# EAGLE schematic ATCUxxxl3U_Synth (EAGLE 5.11)
OC_NEWARK: unknown

## Sheet 1 of 7
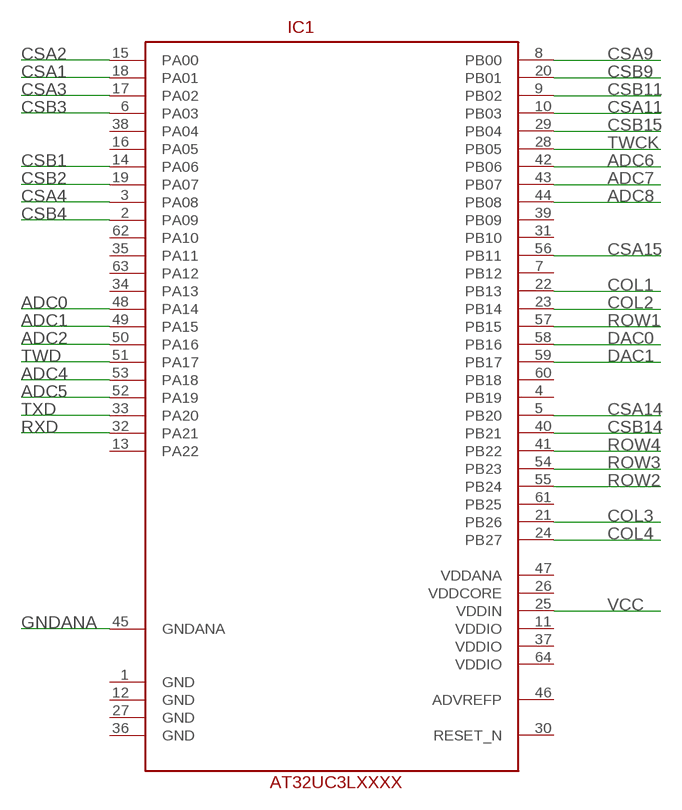
[diagram p0: schematic, sheet 1]

### Parts
IC1  ATCXXXL3U  [TQFP64]

### Nets
ADC0: IC1.48(PA14) ; also sheet 4
ADC1: IC1.49(PA15) ; also sheet 4
ADC2: IC1.50(PA16) ; also sheet 4
ADC4: IC1.53(PA18) ; also sheet 4
ADC5: IC1.52(PA19) ; also sheet 4
ADC6: IC1.42(PB06) ; also sheet 4
ADC7: IC1.43(PB07) ; also sheet 4
ADC8: IC1.44(PB08) ; also sheet 4
COL1: IC1.22(PB13) ; also sheet 7
COL2: IC1.23(PB14) ; also sheet 7
COL3: IC1.21(PB26) ; also sheet 7
COL4: IC1.24(PB27) ; also sheet 7
CSA1: IC1.18(PA01) ; also sheet 2
CSA2: IC1.15(PA00) ; also sheet 2
CSA3: IC1.17(PA02) ; also sheet 2
CSA4: IC1.3(PA08) ; also sheet 2
CSA9: IC1.8(PB00) ; also sheet 2
CSA11: IC1.10(PB03) ; also sheet 2
CSA14: IC1.5(PB20) ; also sheet 2
CSA15: IC1.56(PB11) ; also sheet 2
CSB1: IC1.14(PA06) ; also sheet 2
CSB2: IC1.19(PA07) ; also sheet 2
CSB3: IC1.6(PA03) ; also sheet 2
CSB4: IC1.2(PA09) ; also sheet 2
CSB9: IC1.20(PB01) ; also sheet 2
CSB11: IC1.9(PB02) ; also sheet 2
CSB14: IC1.40(PB21) ; also sheet 2
CSB15: IC1.29(PB04) ; also sheet 2
DAC0: IC1.58(PB16) ; also sheet 3
DAC1: IC1.59(PB17) ; also sheet 3
GNDANA: IC1.45(GNDANA) ; also sheet 4
ROW1: IC1.57(PB15) ; also sheet 7
ROW2: IC1.55(PB24) ; also sheet 7
ROW3: IC1.54(PB23) ; also sheet 7
ROW4: IC1.41(PB22) ; also sheet 7
RXD: IC1.32(PA21) ; also sheet 5
TWCK: IC1.28(PB05) ; also sheet 6
TWD: IC1.51(PA17) ; also sheet 6
TXD: IC1.33(PA20) ; also sheet 5
VCC: IC1.25(VDDIN) ; also sheet 3,4,6
Unconnected: IC1.1(GND) IC1.4(PB19) IC1.7(PB12) IC1.11(VDDIO) IC1.12(GND) IC1.13(PA22) IC1.16(PA05) IC1.26(VDDCORE) IC1.27(GND) IC1.30(RESET_N) IC1.31(PB10) IC1.34(PA13) IC1.35(PA11) IC1.36(GND) IC1.37(VDDIO) IC1.38(PA04) IC1.39(PB09) IC1.46(ADVREFP) IC1.47(VDDANA) IC1.60(PB18) IC1.61(PB25) IC1.62(PA10) IC1.63(PA12) IC1.64(VDDIO)

## Sheet 2 of 7
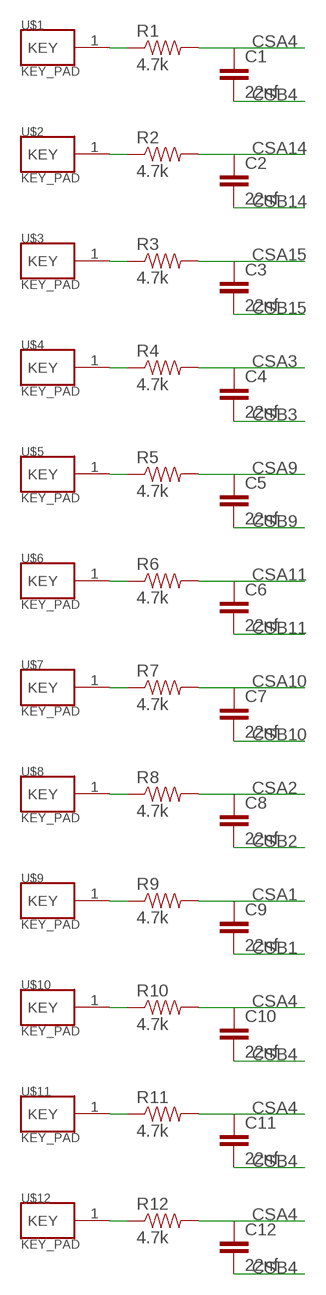
[diagram p1: schematic, sheet 2]

### Parts
C1  22nf  CAP0805  [0805]
C2  22nf  CAP0805  [0805]
C3  22nf  CAP0805  [0805]
C4  22nf  CAP0805  [0805]
C5  22nf  CAP0805  [0805]
C6  22nf  CAP0805  [0805]
C7  22nf  CAP0805  [0805]
C8  22nf  CAP0805  [0805]
C9  22nf  CAP0805  [0805]
C10  22nf  CAP0805  [0805]
C11  22nf  CAP0805  [0805]
C12  22nf  CAP0805  [0805]
R1  4.7k  RESISTOR0805-RES  [0805]
R2  4.7k  RESISTOR0805-RES  [0805]
R3  4.7k  RESISTOR0805-RES  [0805]
R4  4.7k  RESISTOR0805-RES  [0805]
R5  4.7k  RESISTOR0805-RES  [0805]
R6  4.7k  RESISTOR0805-RES  [0805]
R7  4.7k  RESISTOR0805-RES  [0805]
R8  4.7k  RESISTOR0805-RES  [0805]
R9  4.7k  RESISTOR0805-RES  [0805]
R10  4.7k  RESISTOR0805-RES  [0805]
R11  4.7k  RESISTOR0805-RES  [0805]
R12  4.7k  RESISTOR0805-RES  [0805]
U$1  KEY_PAD  [KEY_PAD]
U$2  KEY_PAD  [KEY_PAD]
U$3  KEY_PAD  [KEY_PAD]
U$4  KEY_PAD  [KEY_PAD]
U$5  KEY_PAD  [KEY_PAD]
U$6  KEY_PAD  [KEY_PAD]
U$7  KEY_PAD  [KEY_PAD]
U$8  KEY_PAD  [KEY_PAD]
U$9  KEY_PAD  [KEY_PAD]
U$10  KEY_PAD  [KEY_PAD]
U$11  KEY_PAD  [KEY_PAD]
U$12  KEY_PAD  [KEY_PAD]

### Nets
CSA1: C9.1 R9.2 ; also sheet 1
CSA2: C8.1 R8.2 ; also sheet 1
CSA3: C4.1 R4.2 ; also sheet 1
CSA4: C1.1 C10.1 C11.1 C12.1 R1.2 R10.2 R11.2 R12.2 ; also sheet 1
CSA9: C5.1 R5.2 ; also sheet 1
CSA10: C7.1 R7.2
CSA11: C6.1 R6.2 ; also sheet 1
CSA14: C2.1 R2.2 ; also sheet 1
CSA15: C3.1 R3.2 ; also sheet 1
CSB1: C9.2 ; also sheet 1
CSB2: C8.2 ; also sheet 1
CSB3: C4.2 ; also sheet 1
CSB4: C1.2 C10.2 C11.2 C12.2 ; also sheet 1
CSB9: C5.2 ; also sheet 1
CSB10: C7.2
CSB11: C6.2 ; also sheet 1
CSB14: C2.2 ; also sheet 1
CSB15: C3.2 ; also sheet 1
N$1: R1.1 U$1.1(KEY)
N$2: R2.1 U$2.1(KEY)
N$3: R3.1 U$3.1(KEY)
N$4: R4.1 U$4.1(KEY)
N$5: R5.1 U$5.1(KEY)
N$6: R6.1 U$6.1(KEY)
N$7: R7.1 U$7.1(KEY)
N$8: R8.1 U$8.1(KEY)
N$9: R9.1 U$9.1(KEY)
N$10: R10.1 U$10.1(KEY)
N$11: R11.1 U$11.1(KEY)
N$12: R12.1 U$12.1(KEY)

## Sheet 3 of 7
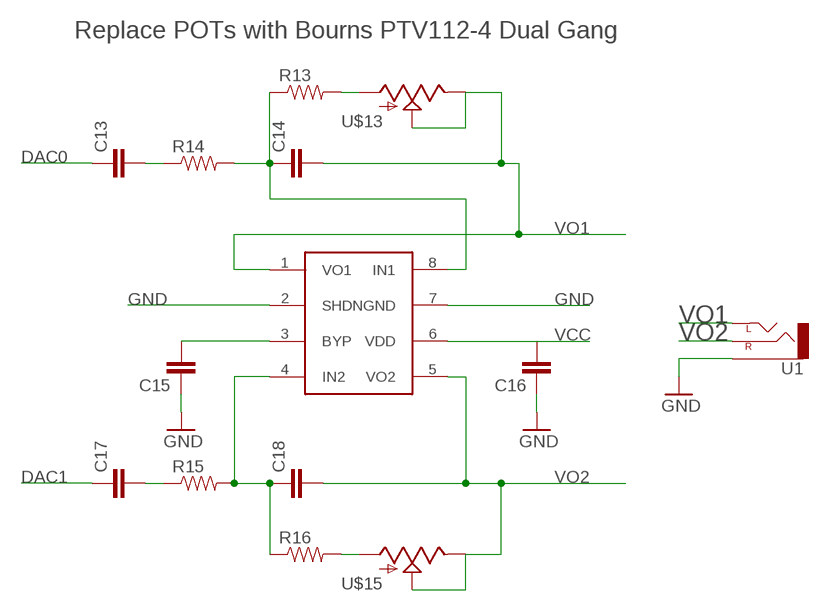
[diagram p2: schematic, sheet 3]

### Parts
C13  CAP0805  [0805]
C14  CAP0805  [0805]
C15  CAP0805  [0805]
C16  CAP0805  [0805]
C17  CAP0805  [0805]
C18  CAP0805  [0805]
R13  RESISTOR0805-RES  [0805]
R14  RESISTOR0805-RES  [0805]
R15  RESISTOR0805-RES  [0805]
R16  RESISTOR0805-RES  [0805]
U1  AUDIO-JACKSMD2  [AUDIO-JACK-3.5MM-SMD]
U$13  POT  [ALPS_POT]
U$14  TPA302  [SO-08@1]
U$15  POT  [ALPS_POT]

### Nets
DAC0: C13.1 ; also sheet 1
DAC1: C17.1 ; also sheet 1
GND: C15.1 C16.1 U1.SLEEVE U$14.2(SHDN) U$14.7(GND) ; also sheet 5,6
N$13: C13.2 R14.1
N$14: C14.1 R13.1 R14.2 U$14.8(IN1)
N$15: C17.2 R15.1
N$16: C18.1 R15.2 R16.1 U$14.4(IN2)
N$17: R13.2 U$13.P$3(A)
N$18: R16.2 U$15.P$3(A)
N$19: C15.2 U$14.3(BYP)
VCC: C16.2 U$14.6(VDD) ; also sheet 1,4,6
VO1: C14.2 U1.TIP(LEFT) U$13.P$1(E) U$13.P$2(S) U$14.1(VO1)
VO2: C18.2 U1.RING(RIGHT) U$14.5(VO2) U$15.P$1(E) U$15.P$2(S)

### Notes on the sheet
- Replace POTs with Bourns PTV112-4 Dual Gang

## Sheet 4 of 7
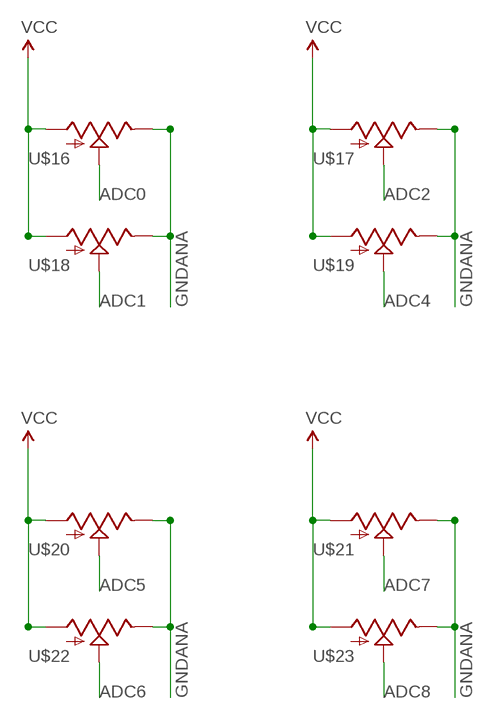
[diagram p3: schematic, sheet 4]

### Parts
U$16  POT  [ALPS_POT]
U$17  POT  [ALPS_POT]
U$18  POT  [ALPS_POT]
U$19  POT  [ALPS_POT]
U$20  POT  [ALPS_POT]
U$21  POT  [ALPS_POT]
U$22  POT  [ALPS_POT]
U$23  POT  [ALPS_POT]

### Nets
ADC0: U$16.P$2(S) ; also sheet 1
ADC1: U$18.P$2(S) ; also sheet 1
ADC2: U$17.P$2(S) ; also sheet 1
ADC4: U$19.P$2(S) ; also sheet 1
ADC5: U$20.P$2(S) ; also sheet 1
ADC6: U$22.P$2(S) ; also sheet 1
ADC7: U$21.P$2(S) ; also sheet 1
ADC8: U$23.P$2(S) ; also sheet 1
GNDANA: U$16.P$1(E) U$17.P$1(E) U$18.P$1(E) U$19.P$1(E) U$20.P$1(E) U$21.P$1(E) U$22.P$1(E) U$23.P$1(E) ; also sheet 1
VCC: U$16.P$3(A) U$17.P$3(A) U$18.P$3(A) U$19.P$3(A) U$20.P$3(A) U$21.P$3(A) U$22.P$3(A) U$23.P$3(A) ; also sheet 1,3,6

## Sheet 5 of 7
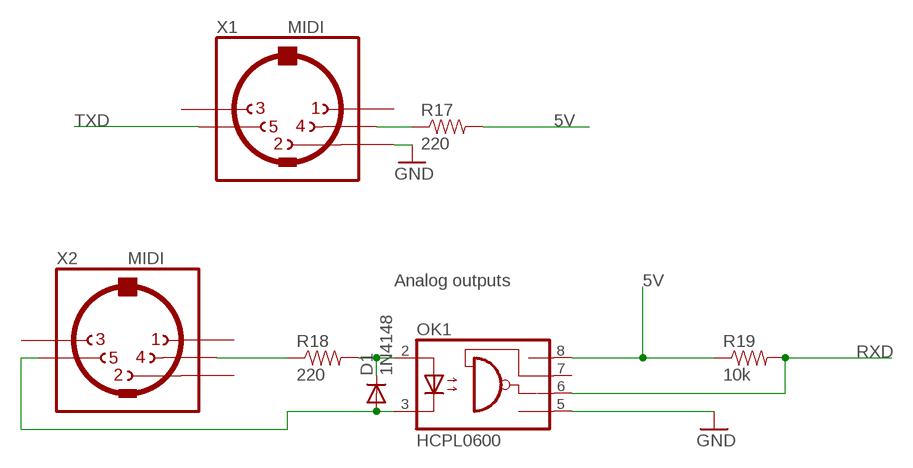
[diagram p4: schematic, sheet 5]

### Parts
D1  1N4148  DIODE-SMB  [SMB]
OK1  HCPL0600  [SOIC08]
R17  220  RESISTOR0805-RES  [0805]
R18  220  RESISTOR0805-RES  [0805]
R19  10k  RESISTOR0805-RES  [0805]
X1  MIDI  MAB5SH  [MAB5SH]
X2  MIDI  MAB5SH  [MAB5SH]

### Nets
5V: OK1.8(VCC) R17.2 R19.1
GND: OK1.5(GND) X1.2 ; also sheet 3,6
N$28: D1.C OK1.2(A) R18.2
N$68: R17.1 X1.4
N$72: R18.1 X2.4
N$73: D1.A OK1.3(C) X2.5
RXD: OK1.6(VO) R19.2 ; also sheet 1
TXD: X1.5 ; also sheet 1
Unconnected: OK1.7(VE) X1.1 X1.3 X2.1 X2.2 X2.3

### Notes on the sheet
- Analog outputs

## Sheet 6 of 7
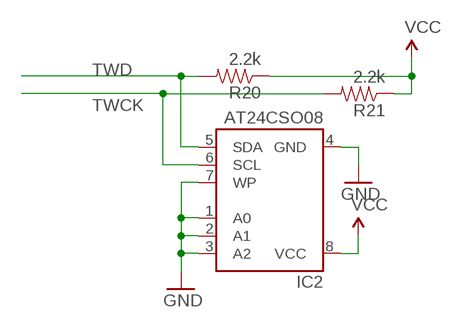
[diagram p5: schematic, sheet 6]

### Parts
IC2  AT24CSO08  [SO-08]
R20  2.2k  RESISTOR0805-RES  [0805]
R21  2.2k  RESISTOR0805-RES  [0805]

### Nets
GND: IC2.1(A0) IC2.2(A1) IC2.3(A2) IC2.4(GND) IC2.7(WP) ; also sheet 3,5
TWCK: IC2.6(SCL) R21.2 ; also sheet 1
TWD: IC2.5(SDA) R20.2 ; also sheet 1
VCC: IC2.8(VCC) R20.1 R21.1 ; also sheet 1,3,4

## Sheet 7 of 7
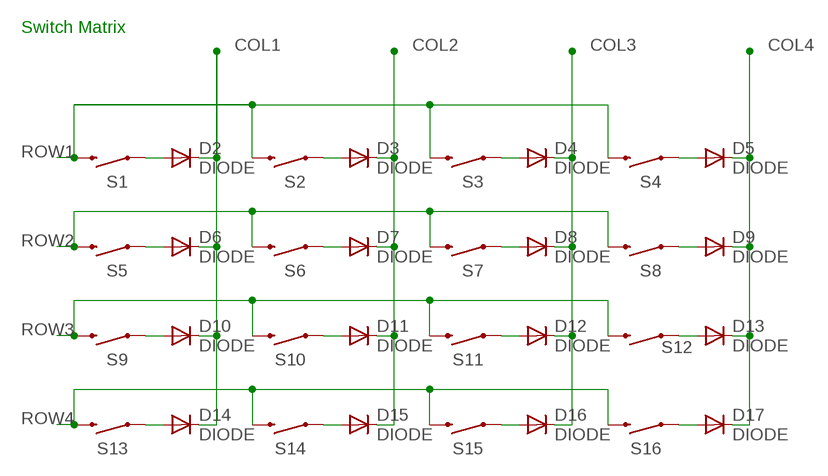
[diagram p6: schematic, sheet 7]

### Parts
D2  DIODE  DIODESOD  [SOD-323]
D3  DIODE  DIODESOD  [SOD-323]
D4  DIODE  DIODESOD  [SOD-323]
D5  DIODE  DIODESOD  [SOD-323]
D6  DIODE  DIODESOD  [SOD-323]
D7  DIODE  DIODESOD  [SOD-323]
D8  DIODE  DIODESOD  [SOD-323]
D9  DIODE  DIODESOD  [SOD-323]
D10  DIODE  DIODESOD  [SOD-323]
D11  DIODE  DIODESOD  [SOD-323]
D12  DIODE  DIODESOD  [SOD-323]
D13  DIODE  DIODESOD  [SOD-323]
D14  DIODE  DIODESOD  [SOD-323]
D15  DIODE  DIODESOD  [SOD-323]
D16  DIODE  DIODESOD  [SOD-323]
D17  DIODE  DIODESOD  [SOD-323]
S1  wave A saw/squ  SWITCH-MOMENTARY-2-SMD-1101NE  [TACTILE-SWITCH-1101NE]
S2  osc b on/off  SWITCH-MOMENTARY-2-SMD-1101NE  [TACTILE-SWITCH-1101NE]
S3  modwheel  SWITCH-MOMENTARY-2-SMD-1101NE  [TACTILE-SWITCH-1101NE]
S4  transpose down/up  SWITCH-MOMENTARY-2-SMD-1101NE  [TACTILE-SWITCH-1101NE]
S5  wave B square/saw  SWITCH-MOMENTARY-2-SMD-1101NE  [TACTILE-SWITCH-1101NE]
S6  octave B down  SWITCH-MOMENTARY-2-SMD-1101NE  [TACTILE-SWITCH-1101NE]
S7  OSCA noise toggle  SWITCH-MOMENTARY-2-SMD-1101NE  [TACTILE-SWITCH-1101NE]
S8  OSCA noise toggle  SWITCH-MOMENTARY-2-SMD-1101NE  [TACTILE-SWITCH-1101NE]
S9  DCF KBD TRACK off/on  SWITCH-MOMENTARY-2-SMD-1101NE  [TACTILE-SWITCH-1101NE]
S10  DCF HP/LP  SWITCH-MOMENTARY-2-SMD-1101NE  [TACTILE-SWITCH-1101NE]
S11  LFO Mod DCO/DCF  SWITCH-MOMENTARY-2-SMD-1101NE  [TACTILE-SWITCH-1101NE]
S12  LFO KBD Sync  SWITCH-MOMENTARY-2-SMD-1101NE  [TACTILE-SWITCH-1101NE]
S13  DCO distort toggle  SWITCH-MOMENTARY-2-SMD-1101NE  [TACTILE-SWITCH-1101NE]
S14  knob bank shift  SWITCH-MOMENTARY-2-SMD-1101NE  [TACTILE-SWITCH-1101NE]
S15  LFO WAVE tri/squa  SWITCH-MOMENTARY-2-SMD-1101NE  [TACTILE-SWITCH-1101NE]
S16  LFO Normal/Rand  SWITCH-MOMENTARY-2-SMD-1101NE  [TACTILE-SWITCH-1101NE]

### Nets
COL1: D2.1(C) D6.1(C) D10.1(C) D14.1(C) ; also sheet 1
COL2: D3.1(C) D7.1(C) D11.1(C) D15.1(C) ; also sheet 1
COL3: D4.1(C) D8.1(C) D12.1(C) D16.1(C) ; also sheet 1
COL4: D5.1(C) D9.1(C) D13.1(C) D17.1(C) ; also sheet 1
N$20: D2.2(A) S1.P$1
N$21: D3.2(A) S2.P$1
N$22: D4.2(A) S3.P$1
N$23: D5.2(A) S4.P$1
N$24: D6.2(A) S5.P$1
N$25: D7.2(A) S6.P$1
N$26: D8.2(A) S7.P$1
N$27: D9.2(A) S8.P$1
N$29: D10.2(A) S9.P$1
N$30: D11.2(A) S10.P$1
N$31: D12.2(A) S11.P$1
N$32: D13.2(A) S12.P$1
N$33: D14.2(A) S13.P$1
N$34: D15.2(A) S14.P$1
N$35: D16.2(A) S15.P$1
N$36: D17.2(A) S16.P$1
ROW1: S1.P$2 S2.P$2 S3.P$2 S4.P$2 ; also sheet 1
ROW2: S5.P$2 S6.P$2 S7.P$2 S8.P$2 ; also sheet 1
ROW3: S9.P$2 S10.P$2 S11.P$2 S12.P$2 ; also sheet 1
ROW4: S13.P$2 S14.P$2 S15.P$2 S16.P$2 ; also sheet 1

### Notes on the sheet
- Switch Matrix

## Library data of the parts
C1-C18 = SparkFun:CAP: Capacitor Standard 0603 ceramic capacitor, and 0.1" leaded capacitor.
D1 = diode:DIODE-: DIODE
D2-D17 = SparkFun:DIODE: Diode These are standard reverse protection diodes and small signal diodes. SMA package can handle up to about 1A. SOD-323 can handle about 200mA. What the SOD-323 package when ordering, there are some mfgs out there that are 5-pin packages.
IC1 = atmel-avr32-michel:ATCXXXL3U
IC2 = ATCUxxxl3U_Synth:AT24C*: 2-wire serial EEPROM
OK1 = optocoupler:HCPL0600: HEWLETT PACKARD OPTO COUPLER; MF: AGILENT TECHNOLOGIES; MPN: HCPL-0600-000E; OC_FARNELL: 9994696; OC_NEWARK: 88H7774
R1-R21 = SparkFun:RESISTOR: Resistor Basic schematic elements and footprints for 0603, 1206, and PTH resistors.
S1-S16 = SparkFun:SWITCH-MOMENTARY-2
U1 = SparkFun:AUDIO-JACK: 3.5mm Audio Jack Simple 3.5mm common PCB mount audio jack. SKU: PRT-08032
U$1-U$12 = ATCUxxxl3U_Synth:KEY_PAD
U$13 U$15-U$23 = SparkFun:POT
U$14 = ATCUxxxl3U_Synth:TPA302
X1 X2 = og-midi:MAB5SH: Female CONNECTOR 5 pins 90 deg. with shield, horizontal (DIN 41524)